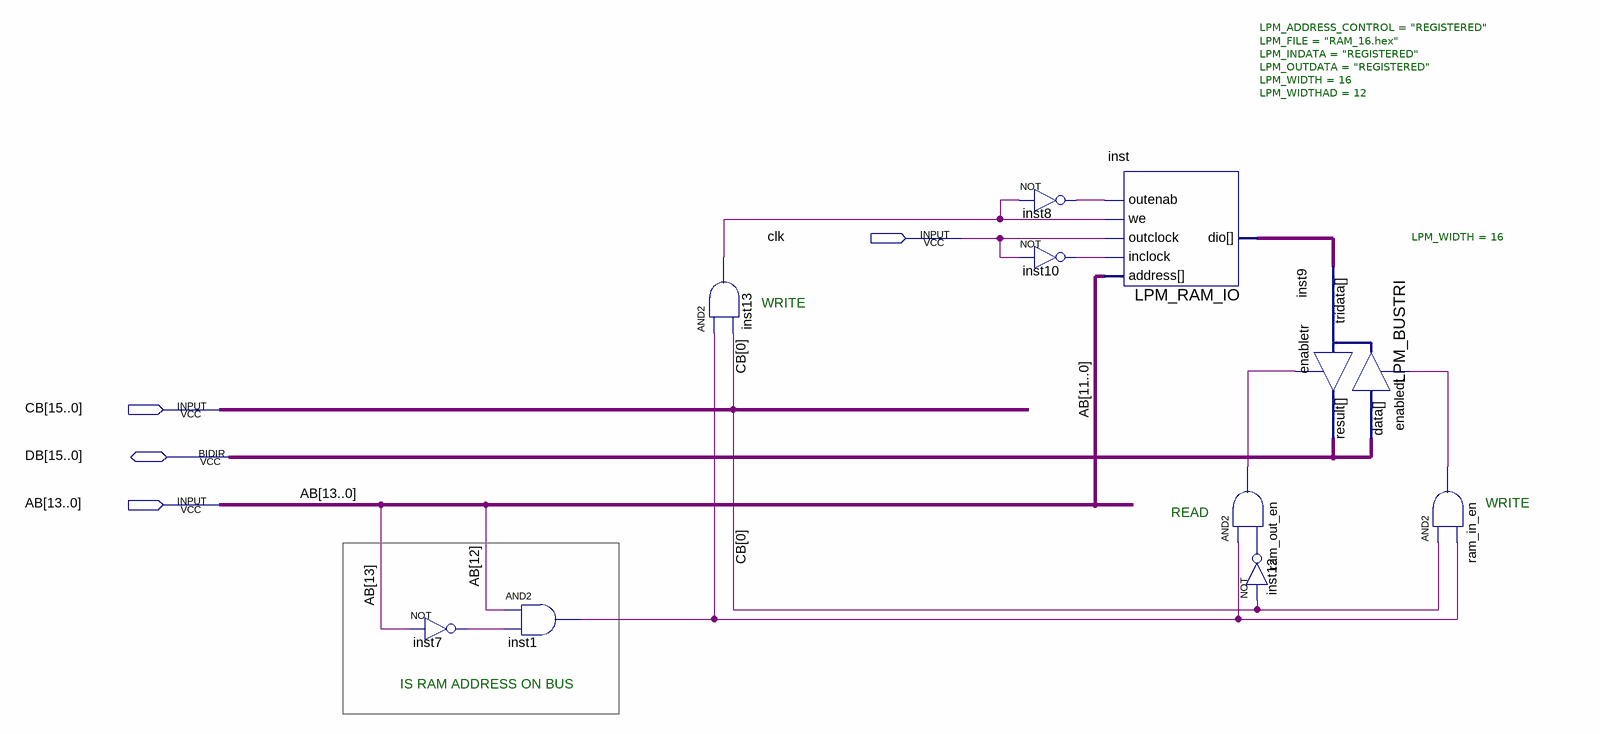
[diagram p0: schematic sheet]
// Quartus schematic RAM.bdf as structural Verilog: 10 symbols, 4 pins
module RAM (
  input  clk,
  input  [15:0] CB,
  input  [13:0] AB,
  inout  [15:0] DB
);

  wire inst1_out, inst7_out, inst8_out, inst10_out, inst12_out, inst13_out, ram_in_en_out, ram_out_en_out;
  wire [15:0] inst_dio;

  not inst7 (inst7_out, AB[13]);
  and inst1 (inst1_out, AB[12], inst7_out);
  and inst13 (inst13_out, inst1_out, CB[0]);
  not inst8 (inst8_out, inst13_out);
  not inst10 (inst10_out, clk);
  LPM_RAM_IO #(.LPM_ADDRESS_CONTROL("REGISTERED"), .LPM_FILE("RAM_16.hex"), .LPM_INDATA("REGISTERED"), .LPM_OUTDATA("REGISTERED"), .LPM_WIDTH(16), .LPM_WIDTHAD(12)) inst (
    .address(AB[11:0]), .outclock(clk), .inclock(inst10_out), .we(inst13_out), .outenab(inst8_out),
    .dio(inst_dio));
  and ram_out_en (ram_out_en_out, inst1_out, inst12_out);
  LPM_BUSTRI #(.LPM_WIDTH(16)) inst9 (
    .data(DB), .enabledt(ram_in_en_out), .enabletr(ram_out_en_out), .result(DB), .tridata(inst_dio));
  not inst12 (inst12_out, CB[0]);
  and ram_in_en (ram_in_en_out, CB[0], inst1_out);

  // Notes on the sheet:
  //   WRITE
  //   WRITE
  //   READ
  //   IS RAM ADDRESS ON BUS
endmodule
